# Altium project Receiver_1_5.PrjPCB
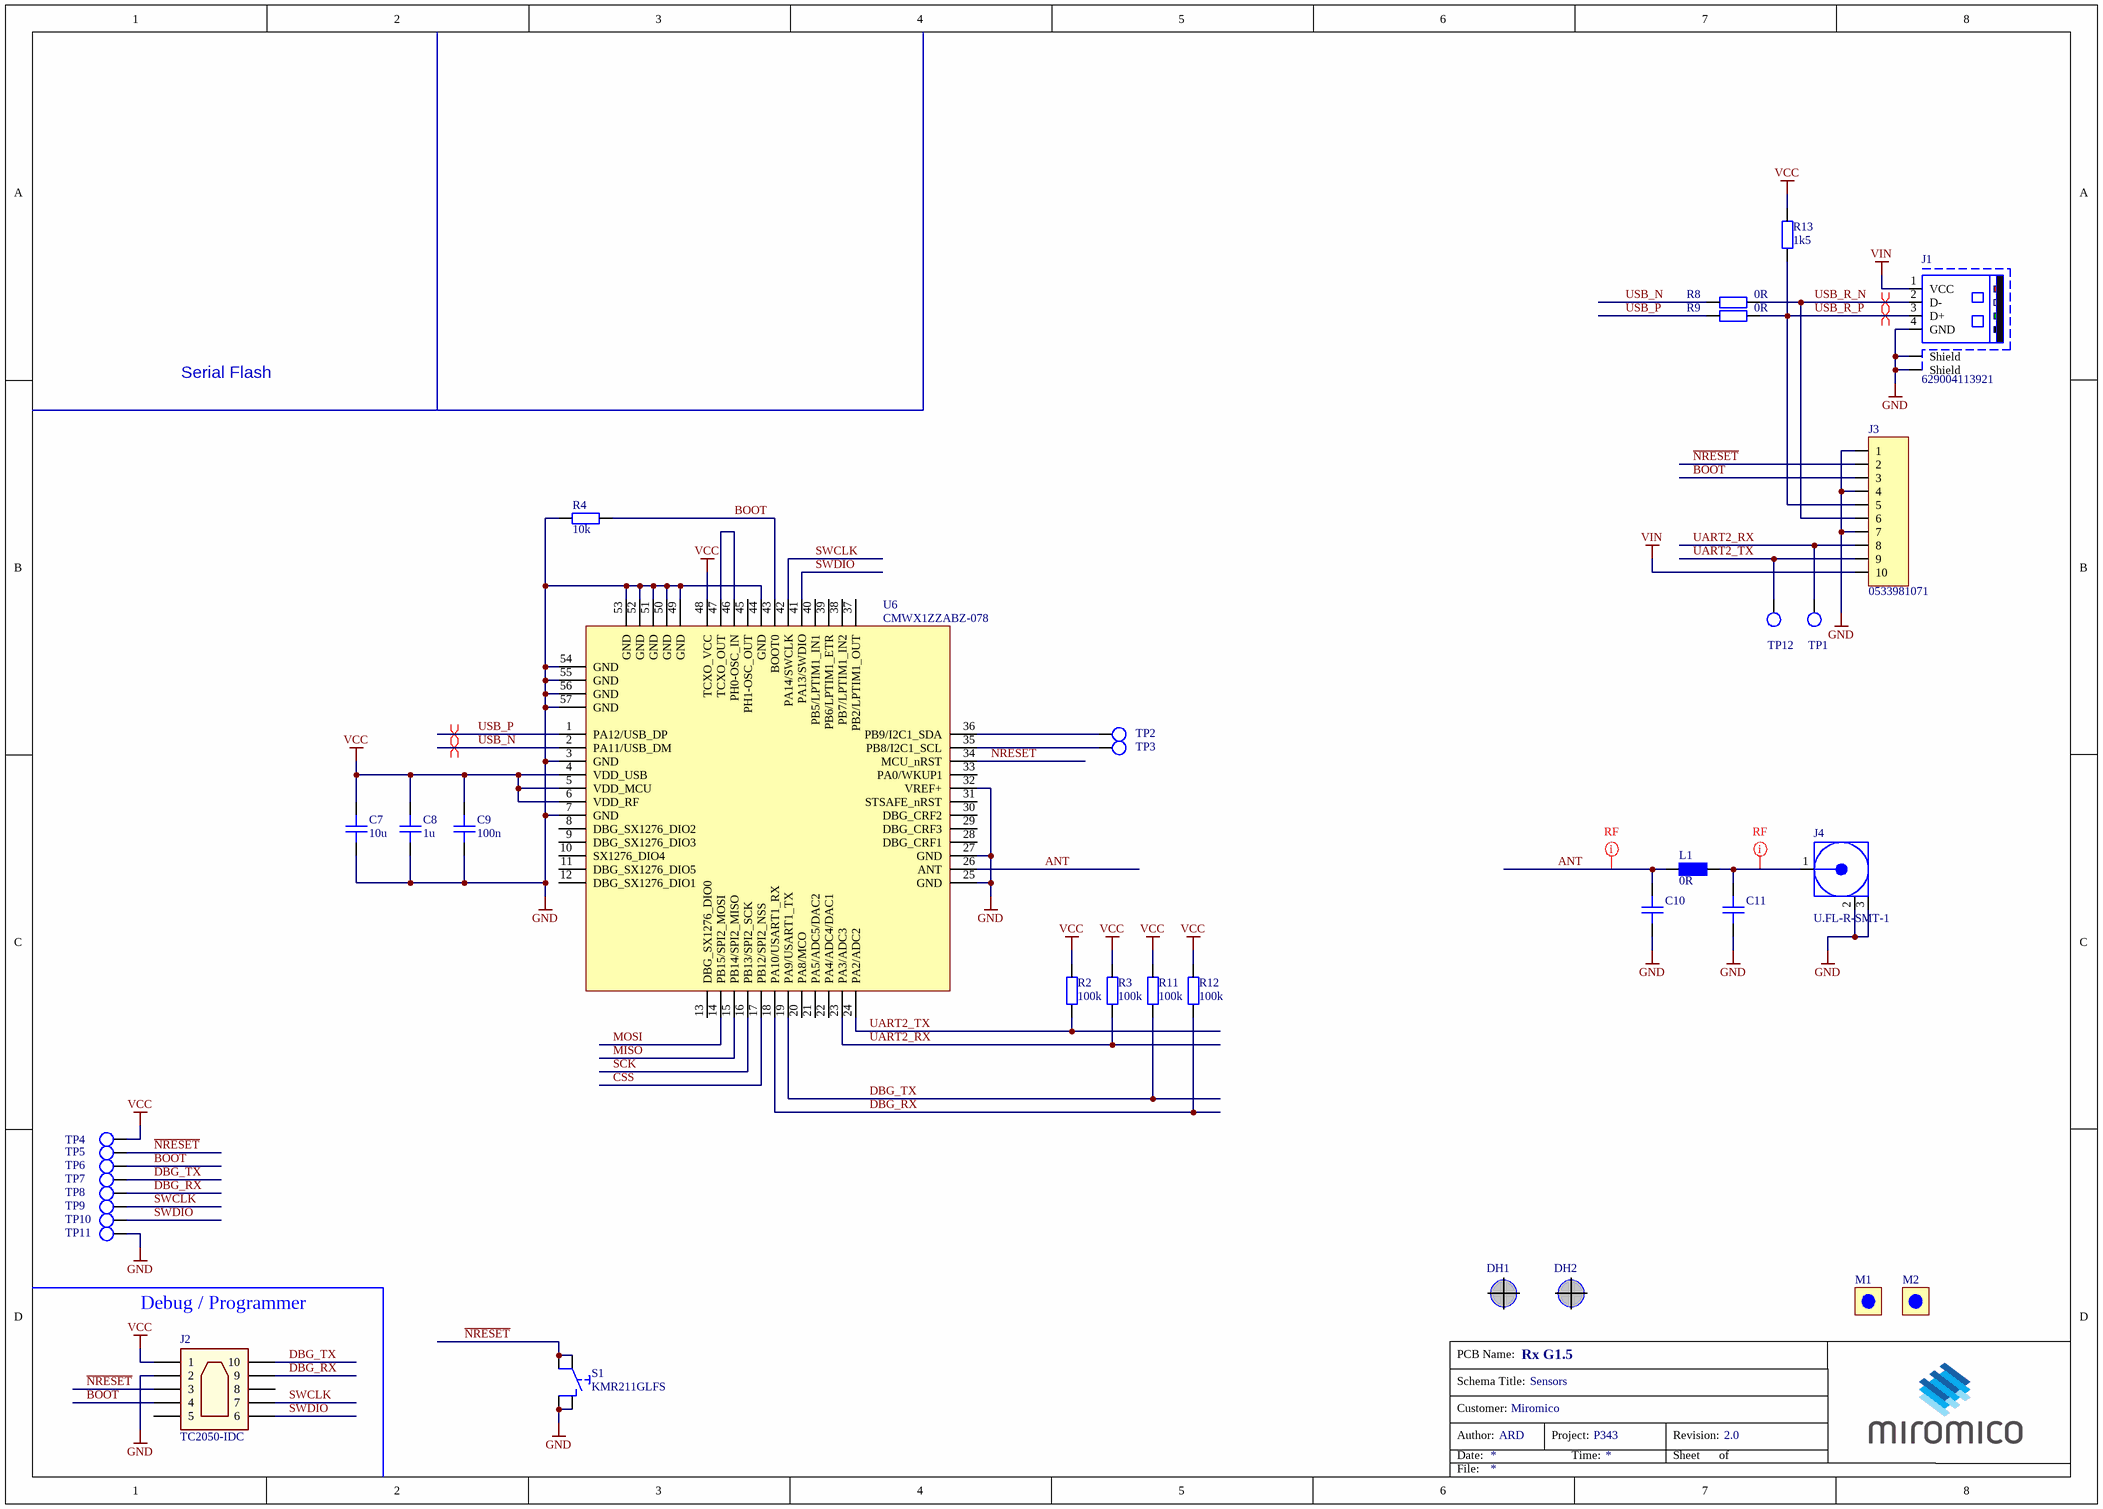
[diagram p0: Receiver_1_5.SchDoc]
AuthorMiromico: ARD; BoardRevision: 2; Customer: Miromico; PCBName: Rx G1.5; ProjectNumberMiromico: P343; ProjectRevision: 2.0
1 sheet, 36 parts. Net scope: global (net labels, ports and power ports of the same name join across sheets).
Board files: Receiver_1_5.PcbDoc, Rx_1_5_Nutzen_v2.PcbDoc

## Sheet Receiver_1_5.SchDoc
size A3; Organization: Miromico AG; Address1: Miromico AG; Address2: Embedded Systems; Address3: Gallusstrasse 4; Address4: CH-8006 Zürich; SchemaTitle: Sensors; PageSetup: Record=PageOptions|CenterHorizontal=True|CenterVertical=True|PrintScale=1.00|XCorrection=1.00|YCorrection=1.00|PrintKind=1|BorderSize=5000000|LeftOffset=0|BottomOffset=0|Orientation=1|PaperLength=1000|PaperWidth=1000|Scale=100|PaperSource=7|PrintQuality=-4|MediaType=1|DitherType=10|PaperKind=A4|PrintScaleMode=1

### Parts
C7  10u  [CAPC0402(1005)60_L]
C8  1u  [CAPC0402(1005)60_L]
C9  100n  [CAPC0402(1005)60_L]
C10  (no value)  [CAPC0402(1005)60_L]
C11  (no value)  [CAPC0402(1005)60_L]
DH1  Drill hole M2.5_nonplated  [Drill hole M2.5_nonplated]  (value not drawn)  (no BOM)
DH2  Drill hole M2.5_nonplated  [Drill hole M2.5_nonplated]  (value not drawn)  (no BOM)
J1  629004113921  [629004113921]
J2  TC2050-IDC  [TC2050-IDC-NL-10]  (no BOM)
J3  0533981071  [0533981071]
J4  U.FL-R-SMT-1  [U.FL]
L1  0R  [L_0402_HF]
M1  Fiducial Round  [Fiducial round_small]  (value not drawn)  (no BOM)
M2  Fiducial Round  [Fiducial round_small]  (value not drawn)  (no BOM)
R2  100k  [RESC0402(1005)_L]
R3  100k  [RESC0402(1005)_L]
R4  10k  [RESC0402(1005)_L]
R8  0R  [RESC0402(1005)_L]
R9  0R  [RESC0402(1005)_L]
R11  100k  [RESC0402(1005)_L]
R12  100k  [RESC0402(1005)_L]
R13  1k5  [RESC0402(1005)_L]
S1  KMR211GLFS  [KMR211GLFS]
TP1  Testpoint 1.5mm  [Testpoint SMD 1.5mm]  (value not drawn)  (no BOM)
TP2  Testpoint 1.5mm  [Testpoint SMD 1.5mm]  (value not drawn)  (no BOM)
TP3  Testpoint 1.5mm  [Testpoint SMD 1.5mm]  (value not drawn)  (no BOM)
TP4  Testpoint 1.5mm  [Testpoint SMD 1.5mm]  (value not drawn)  (no BOM)
TP5  Testpoint 1.5mm  [Testpoint SMD 1.5mm]  (value not drawn)  (no BOM)
TP6  Testpoint 1.5mm  [Testpoint SMD 1.5mm]  (value not drawn)  (no BOM)
TP7  Testpoint 1.5mm  [Testpoint SMD 1.5mm]  (value not drawn)  (no BOM)
TP8  Testpoint 1.5mm  [Testpoint SMD 1.5mm]  (value not drawn)  (no BOM)
TP9  Testpoint 1.5mm  [Testpoint SMD 1.5mm]  (value not drawn)  (no BOM)
TP10  Testpoint 1.5mm  [Testpoint SMD 1.5mm]  (value not drawn)  (no BOM)
TP11  Testpoint 1.5mm  [Testpoint SMD 1.5mm]  (value not drawn)  (no BOM)
TP12  Testpoint 1.5mm  [Testpoint SMD 1.5mm]  (value not drawn)  (no BOM)
U6  CMWX1ZZABZ-078  [CMWX1ZZABZ]

### Nets
GND: C7.1 C8.1 C9.1 C10.2 C11.2 J1.4(GND) J1.Z1(Shield) J1.Z2(Shield) J2.2 J3.1 J3.4 J3.7 J4.2(GND) J4.3(GND) R4.2 S1.3 S1.4 TP11.1 U6.3(GND) U6.7(GND) U6.25(GND) U6.27(GND) U6.32(VREF+) U6.44(GND) U6.49(GND) U6.50(GND) U6.51(GND) U6.52(GND) U6.53(GND) U6.54(GND) U6.55(GND) U6.56(GND) U6.57(GND)
VCC: C7.2 C8.2 C9.2 J2.1 R2.1 R3.1 R11.1 R12.1 R13.1 TP4.1 U6.4(VDD_USB) U6.5(VDD_MCU) U6.6(VDD_RF) U6.48(TCXO_VCC)
VIN: J1.1(VCC) J3.10
~{NRESET}: J2.3 J3.2 S1.1 S1.2 TP5.1 U6.34(MCU_nRST)
ANT: C10.1 L1.2 U6.26(ANT)
BOOT: J2.4 J3.3 R4.1 TP6.1 U6.43(BOOT0)
CSS: U6.17(PB12/SPI2_NSS)
DBG_RX: J2.9 R12.2 TP8.1 U6.18(PA10/USART1_RX)
DBG_TX: J2.10 R11.2 TP7.1 U6.19(PA9/USART1_TX)
MISO: U6.15(PB14/SPI2_MISO)
MOSI: U6.14(PB15/SPI2_MOSI)
SCK: U6.16(PB13/SPI2_SCK)
SWCLK: J2.7 TP9.1 U6.42(PA14/SWCLK)
SWDIO: J2.6 TP10.1 U6.41(PA13/SWDIO)
UART2_RX: J3.8 R3.2 TP1.1 U6.23(PA3/ADC3)
UART2_TX: J3.9 R2.2 TP12.1 U6.24(PA2/ADC2)
USB_N: R8.1 U6.2(PA11/USB_DM)
USB_P: R9.1 U6.1(PA12/USB_DP)
USB_R_N: J1.2(D-) J3.6 R8.2
USB_R_P: J1.3(D+) J3.5 R9.2 R13.2
NetC11_1: C11.1 J4.1(Signal) L1.1
NetTP2_1: TP2.1 U6.36(PB9/I2C1_SDA)
NetTP3_1: TP3.1 U6.35(PB8/I2C1_SCL)
NetU6_46: U6.46(PH0-OSC_IN) U6.47(TCXO_OUT)

Not connected (* = marked no-connect by the designer): J2 5 8; U6 8(DBG_SX1276_DIO2) 9(DBG_SX1276_DIO3) 10(SX1276_DIO4) 11(DBG_SX1276_DIO5) 12(DBG_SX1276_DIO1) 13(DBG_SX1276_DIO0) 20(PA8/MCO) 21(PA5/ADC5/DAC2) 22(PA4/ADC4/DAC1) 28(DBG_CRF1) 29(DBG_CRF3) 30(DBG_CRF2) 31(STSAFE_nRST) 33(PA0/WKUP1) 37(PB2/LPTIM1_OUT) 38(PB7/LPTIM1_IN2) 39(PB6/LPTIM1_ETR) 40(PB5/LPTIM1_IN1) 45(PH1-OSC_OUT)

### Layout directives
net class RF: ANT, NetC11_1
differential pair: USB_N, USB_P, USB_R_N, USB_R_P

### Notes on the sheet
- Serial Flash
- Debug / Programmer
- Schema Title:
- PCB Name:
- Author:
- Date:
- Customer:
- Project:
- Time:
- Revision:
- Sheet
- of
- File:

### Library data of the parts
C7-C9 = C_Chip_03: Chip Capacitor; Properties: 5%, 50V, X7R; SchLibComponentName: C_Chip
C10 = C_Chip-03: Chip Capacitor; Manufacturer: Murata Electronics North America; Temperature Coefficient: C0G, NP0; Tolerance: ±0.1pF; Voltage - Rated: 50V; ComponentLink1Description: Datasheet; ComponentLink1URL: http://www.murata.com/~/media/webrenewal/support/library/catalog/products/capacitor/mlcc/c02e.ashx; Supplier 1: Digi-Key
C11 = C_Chip-03: Chip Capacitor; Manufacturer: Murata Electronics North America; Properties: 50V, NPO; Temperature Coefficient: C0G, NP0; Tolerance: ±0.1pF; Voltage - Rated: 50V; ComponentLink1Description: Datasheet; Supplier 1: Digi-Key
DH1 DH2 = Drill hole M2.5_nonplated-01
J1 = 629004113921-01: WR-COM USB Type A SMT with Clip; Manufacturer: Wurth Electronics Inc; Connector Type: USB - A; Number of Contacts: 4; Gender: Plug; SchLibComponentName: 629004113921; Supplier 1: Digi-Key; Manufacturer Part Number: 629004113921; RoHS: RoHS Compliant; Category: Connectors, Interconnects; Stock 1: 415; Pricing 1: 1=2.25, 10=1.95, 50=1.8376, 100=1.65, 500=1.5 (USD); Packaging: Tube; Specifications: -; Mounting Type: Surface Mount, Right Angle, Horizontal; Features: Board Lock, Shielded; Ingress Protection: -; ComponentLink1URL: http://katalog.we-online.de/em/datasheet/629004113921.pdf; ComponentLink1Description: Datasheet; Supplier 2: Farnell; Supplier 3: Mouser; Supplier Part Number 1: 732-3182-5-ND; Supplier Part Number 2: 2442732; Supplier Part Number 3: 710-629004113921
J2 = TDC2050-IDC-01: TDC2050-IDC, 10Pins, dual footprint (leg and no-legs); Manufacturer: Tag-Connect; SchLibComponentName: TC2050-IDC; ComponentLink1Description: Datasheet; ComponentLink1URL: http://www.tag-connect.com/Materials/TC2050-IDC%20Datasheet.pdf; Manufacturer Part Number: TC2050-IDC
J3 = 0533981071-01: CONN HEADER 10POS 1.25MM VRT SMD; Manufacturer: Molex, LLC; Connector Type: Header, Shrouded; Number of Positions: 10; Number of Positions Loaded: All; Pitch: 0.049" (1.25mm); SchLibComponentName: 0533981071; Supplier 1: Digi-Key; Manufacturer Part Number: 0533981071; RoHS: RoHS Compliant; Category: Connectors, Interconnects; Stock 1: 7748; Pricing 1: 1=1.74, 10=1.582, 25=1.4848, 50=1.4202, 100=1.3557, 250=1.22664, 500=1.12978 (USD); Packaging: Cut Tape (CT); Part Status: Active; Contact Type: Male Blade; Number of Rows: 1; Row Spacing: -; Contact Mating Length: -; Mounting Type: Surface Mount; Termination: Solder; Fastening Type: Detent Lock; Features: Solder Retention; Contact Finish: Tin; Contact Finish Thickness: 39µin (1.00µm); Color: Natural; ComponentLink1URL: http://www.molex.com/pdm_docs/sd/533981071_sd.pdf; ComponentLink1Description: Datasheet; Supplier Part Number 1: WM7614CT-ND
J4 = COAX - U.FL-R-SMT-1: Ultra Small Surface Mount Coaxial Connectors; Manufacturer: Hirose Electric Co Ltd; Placetec Part Number: 182-916100000000; Connector Style: Ultra Miniature Coaxial; Connector Type: Receptacle, Male Pins; Impedance: 50 Ohm; Frequency - Max: 6GHz; Contact Termination: Solder; Supplier 1: Digi-Key; Supplier Part Number 1: H11891CT-ND; Category: Connectors, Interconnects; RoHS: RoHS Compliant; Manufacturer Part Number: U.FL-R-SMT-1; Packaging: Cut Tape (CT); Fastening Type: Snap-On; Mounting Type: Surface Mount; ComponentLink1URL: http://www.hirose.co.jp/cataloge_hp/e32119372.pdf; ComponentLink1Description: http://www.hirose.co.jp/cataloge_hp/e32119372.pdf; Safemine Part Number: *
L1 = L_Chip_0402_HF-01: Chip Inductor; Tolerance: ±1%; Supplier 1: Digi-Key; Value: 0R
M1 M2 = Fiducial Round-04: Fiducial (Optical Marker)
R2 R3 R11 R12 = R_Chip-05: Chip Resistor; Properties: 1%; SchLibComponentName: R_Chip
R4 R8 R9 = R_Chip-05: Chip Resistor; Properties: 1%; SchLibComponentName: R_Chip
R13 = R_Chip-02: Chip Resistor; Properties: 1%
S1 = KMR211GLFS-01: SWITCH TACTILE SPST-NO 0.05A 32V; Manufacturer: C&K Components; Switch Function: Off-Mom; Contact Rating @ Voltage: 0.05A @ 32VDC; Actuator Type: Standard; Actuator Height off PCB, from Pins: 1.90mm; Actuator Orientation: Top Actuated; Outline: 4.60mm x 2.80mm; Illumination: Non-Illuminated; Operating Force: 120gf; Switch Travel: 0.20mm; Mechanical Life: 200,000 Cycles; SchLibComponentName: KMR211GLFS; Supplier 1: Digi-Key; Supplier Part Number 1: 401-1426-1-ND; Manufacturer Part Number: KMR211GLFS; RoHS: RoHS Compliant; Category: Switches; Stock 1: 31963; Pricing 1: 1=0.51, 10=0.493, 25=0.484, 50=0.4656, 100=0.4017, 250=0.3652, 500=0.34694, 1000=0.2739 (USD); Packaging: Cut Tape (CT); Circuit: SPST-NO; Mounting Type: Surface Mount; Termination Style: Gull Wing; Illumination Voltage (Nominal): -; Illumination Type, Color: -; Ingress Protection: -; Features: Grounding Pin; Actuator Material: -; Operating Temperature: -40°C ~ 85°C; ComponentLink1URL: http://www.ck-components.com/index.php?module=media&action=Display&cmpref=14414&lang=en&width=&height=&format=&alt=; ComponentLink1Description: http://www.ck-components.com/index.php?module=media&action=Display&cmpref=14414&lang=en&width=&height=&format=&alt=
TP1-TP12 = Testpoint SMD 1.5mm-02: Testpoint SMD 1.5mm; SchLibComponentName: Testpoint 1.5mm
U6 = CMWX1ZZABZ-078: LORA MODULE; Manufacturer: Murata Electronics North America; Supplier 1: Digikey; Manufacturer Part Number: CMWX1ZZABZ-078; Supplier Part Number 1: 490-16143-1-ND; ComponentLink1Description: Datasheet; ComponentLink1URL: http://wireless.murata.com/RFM/data/type_abz.pdf

## Assembly variants
default: not fitted C1 C3 C4 C10 C11 D1 J1 R5 R6 R7 R13 S1 U1